# EAGLE schematic generation_board_f1 (EAGLE 8.7.1)
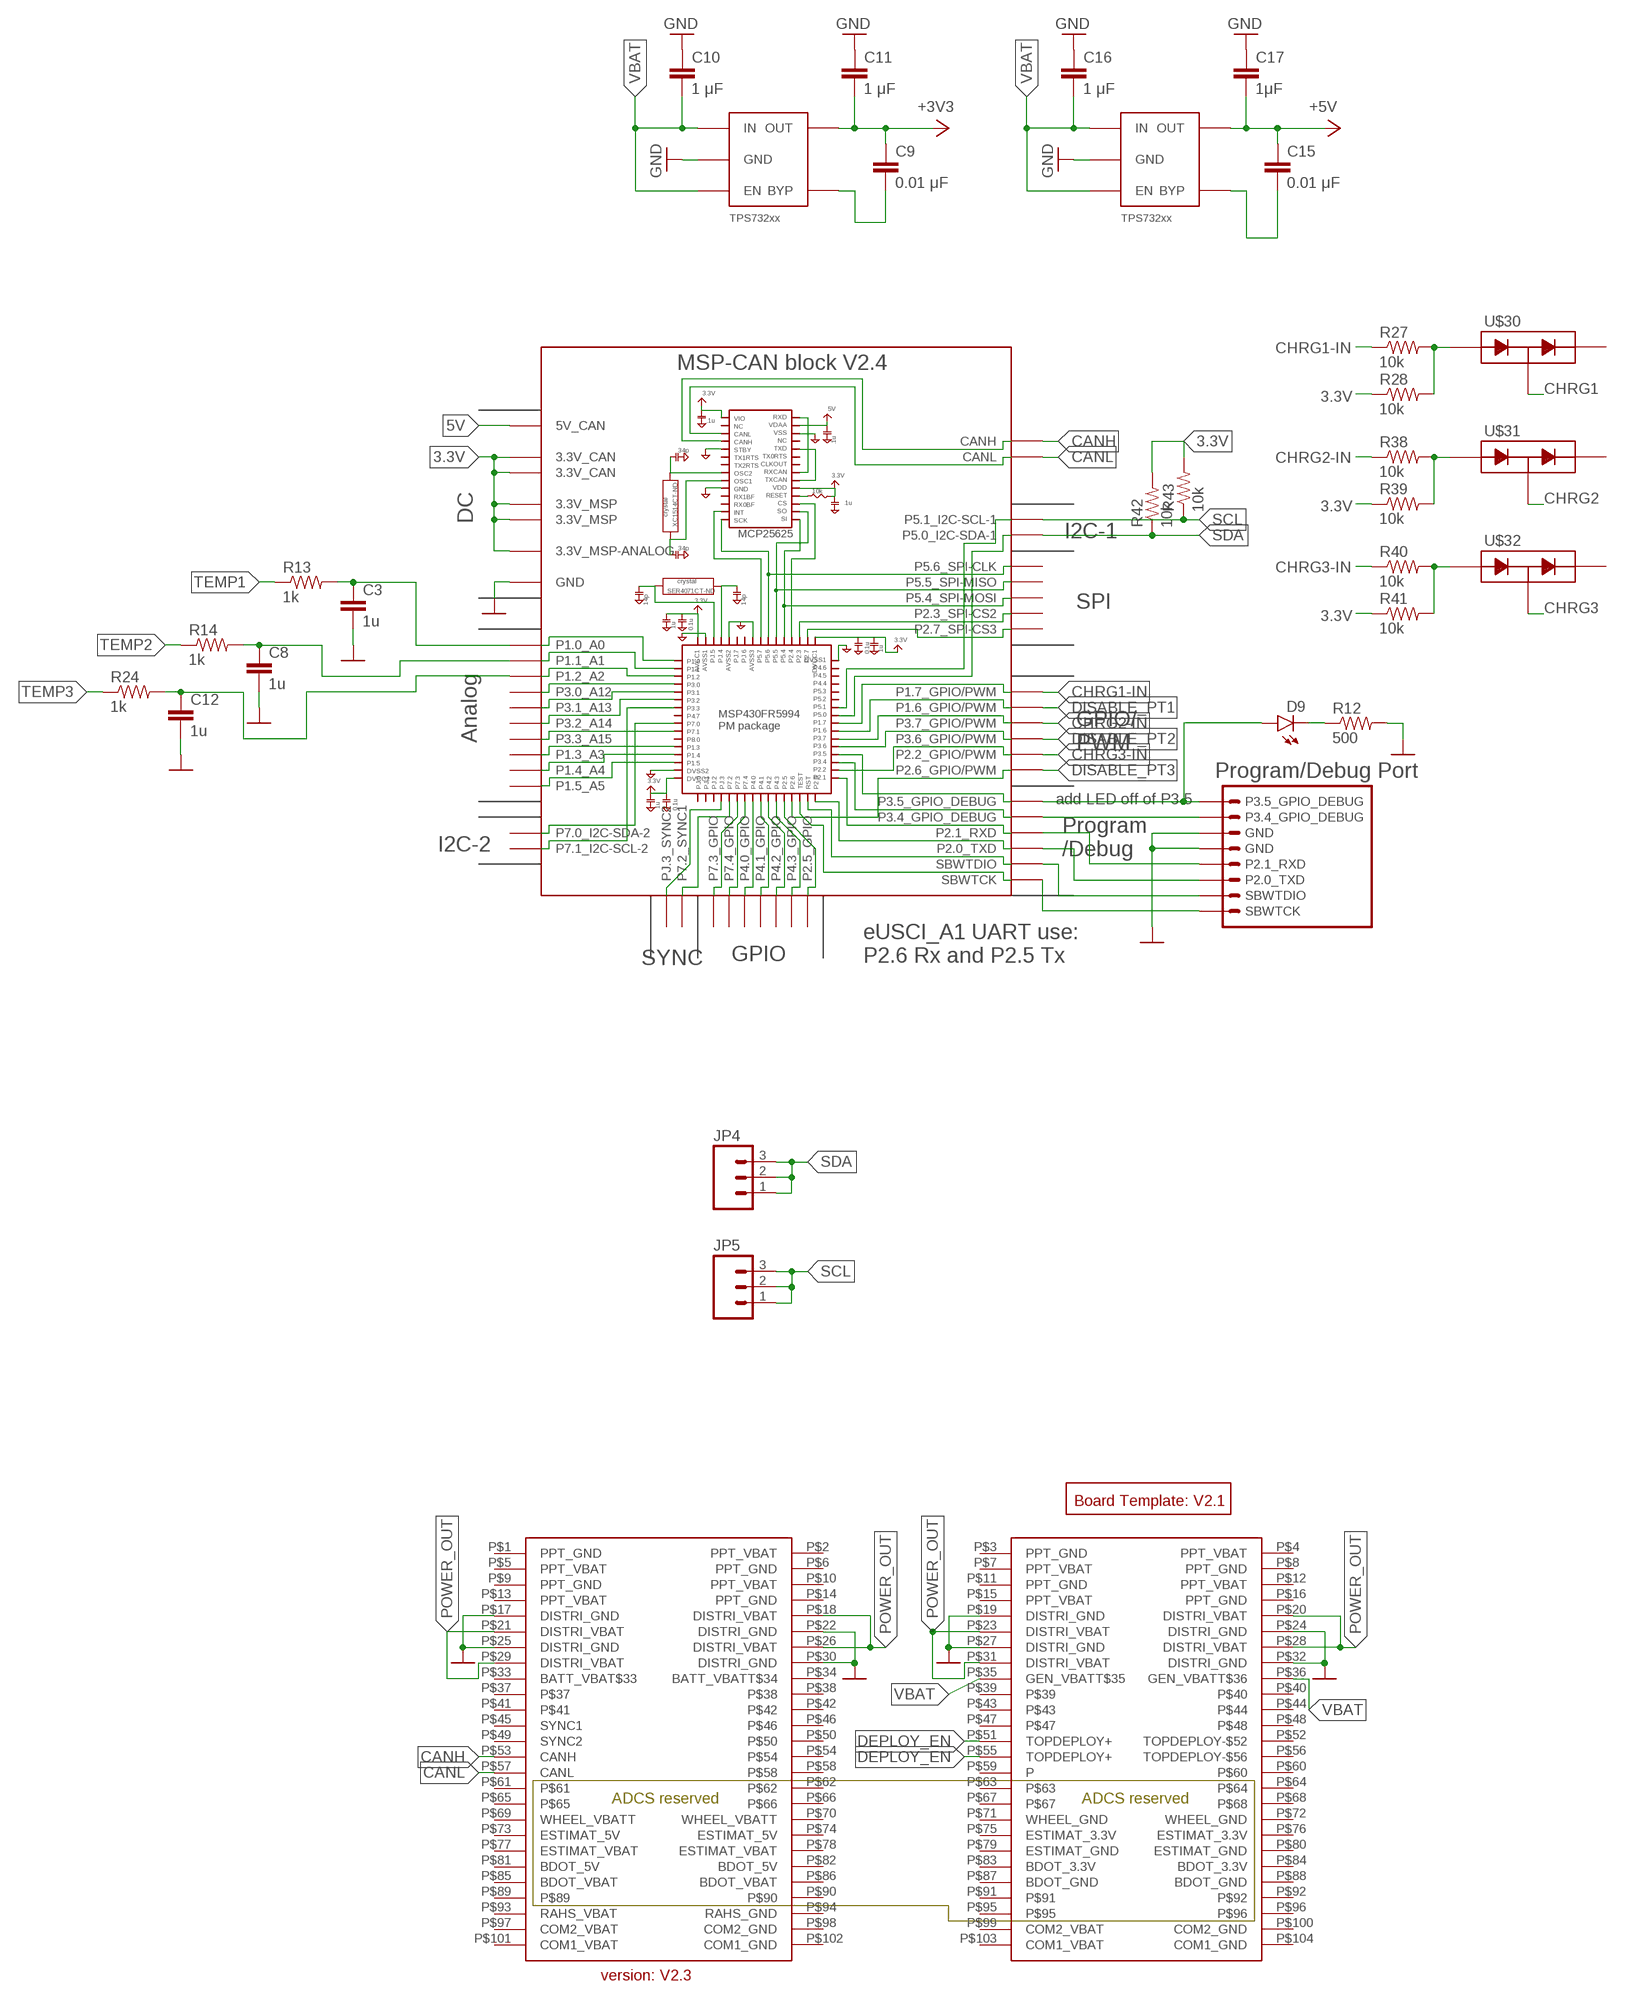
[diagram p0: schematic, sheet 1, part 1 of 2]
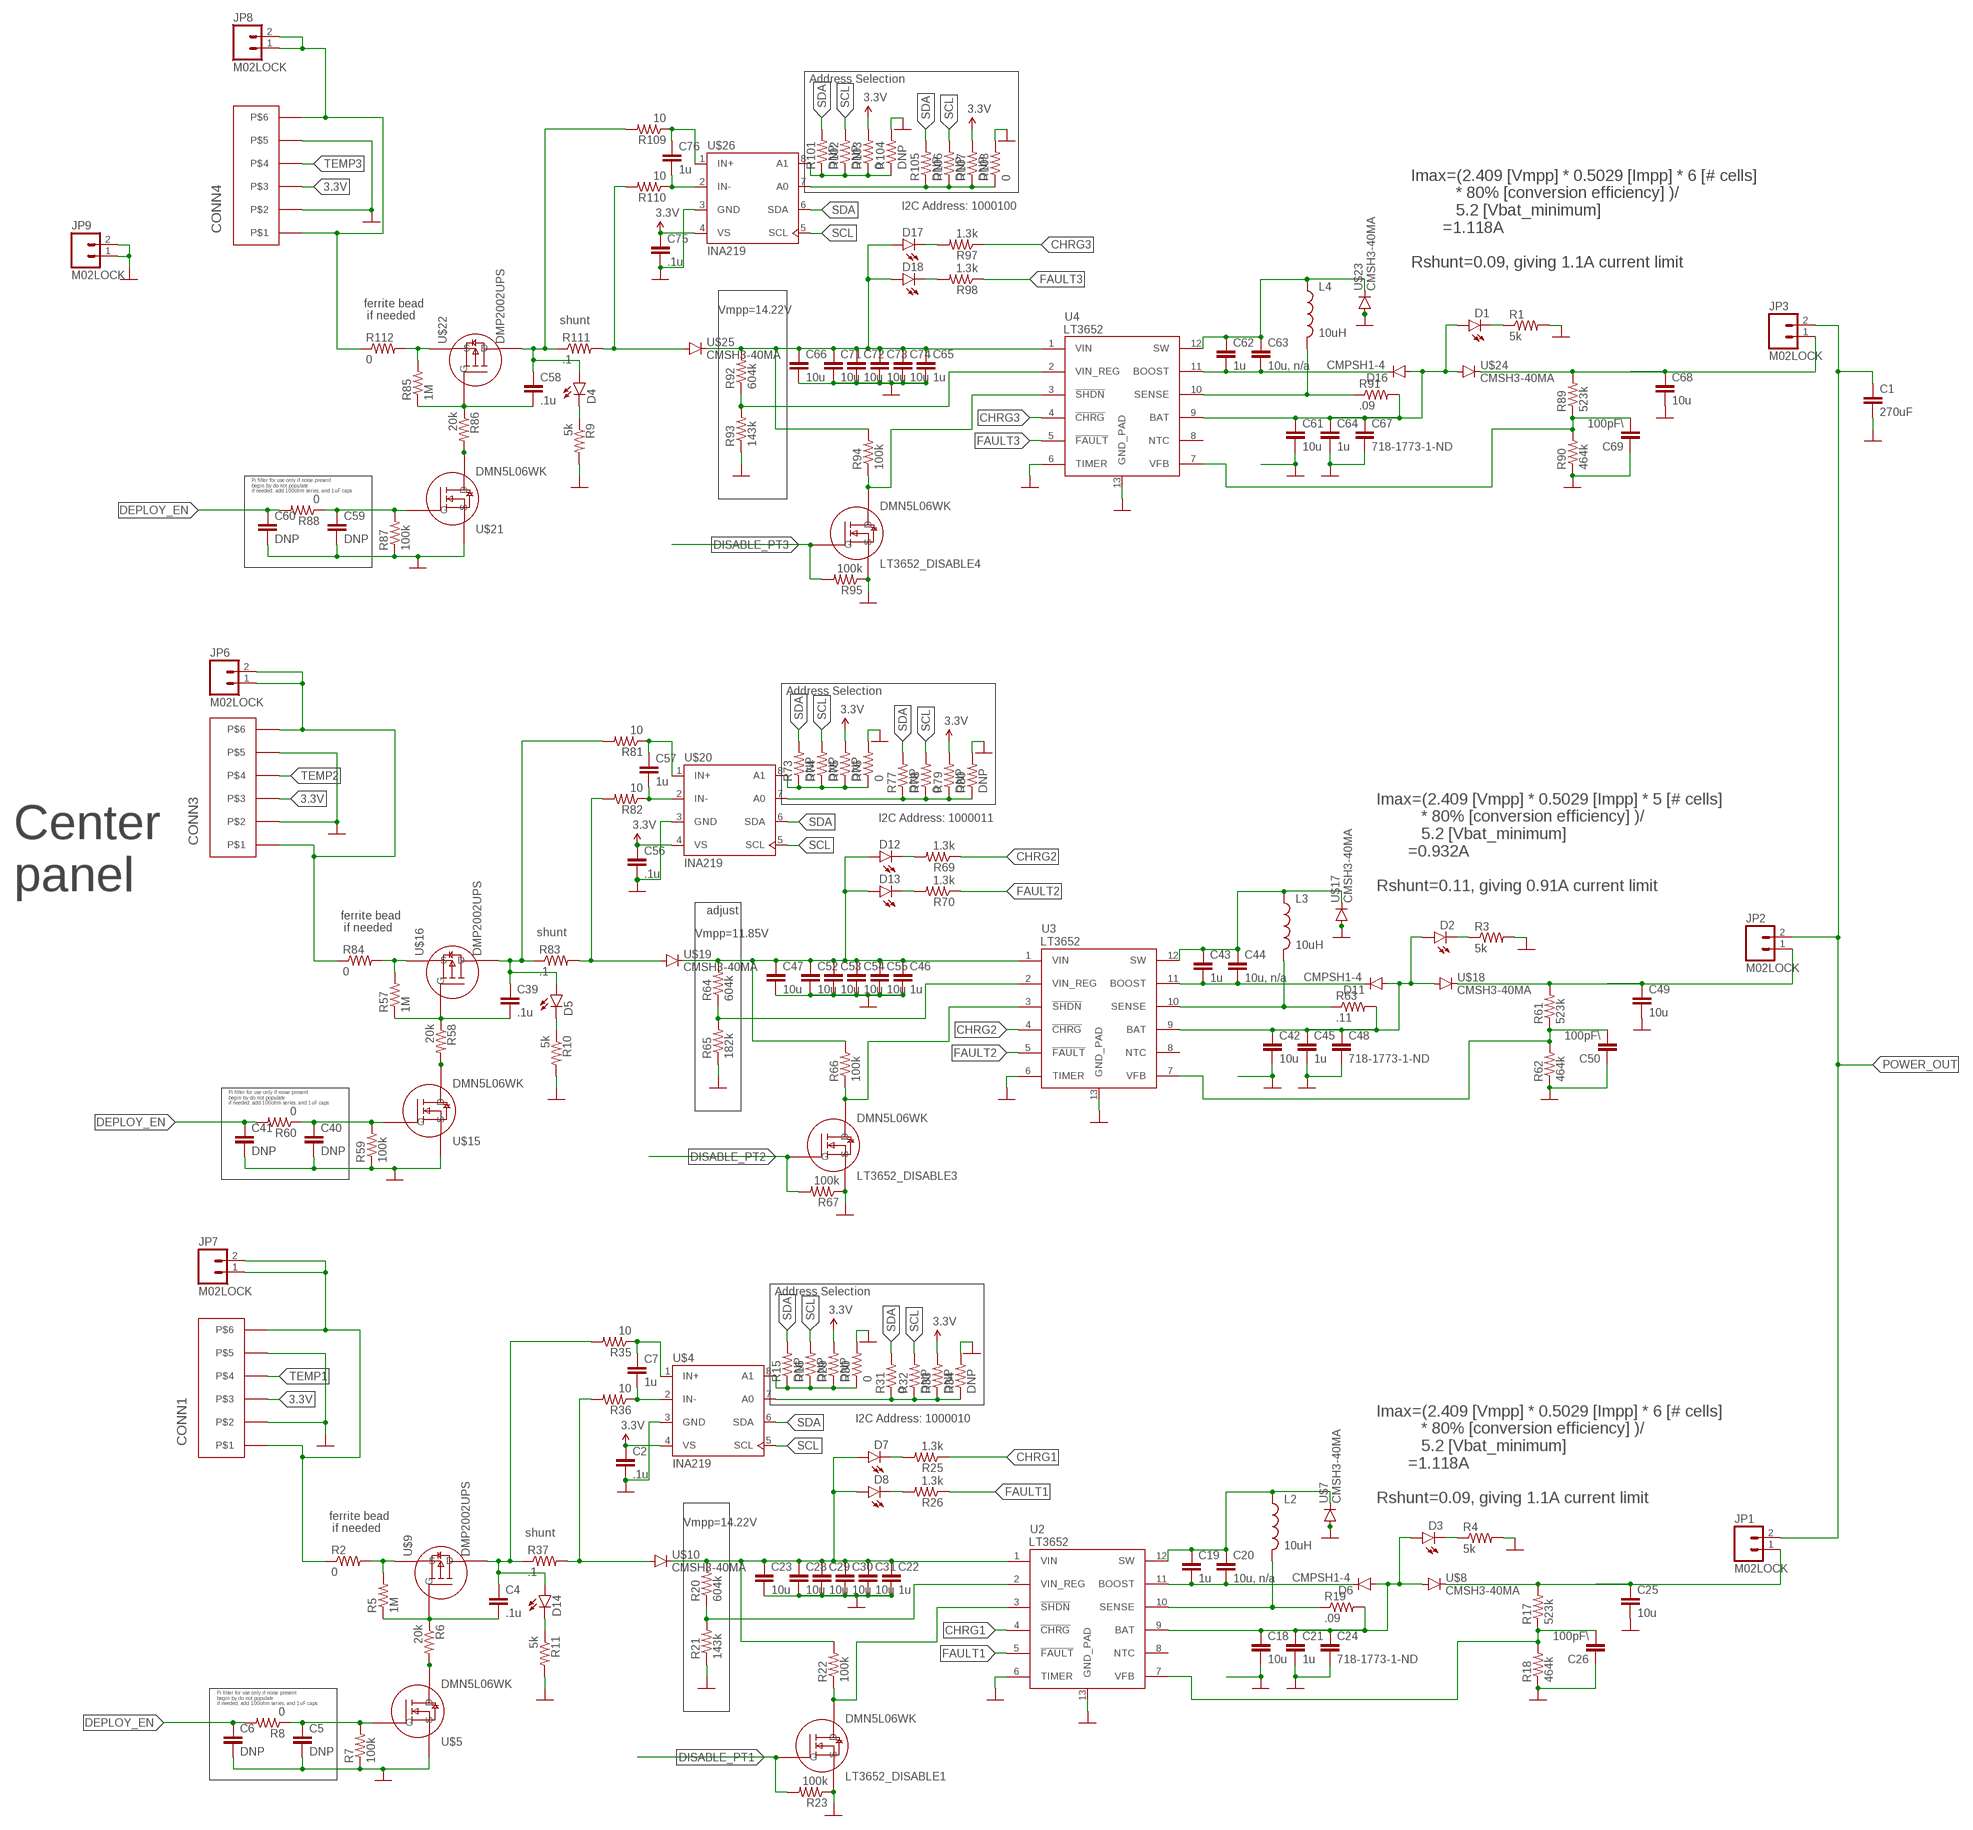
[diagram p1: schematic, sheet 1, part 2 of 2]

## Parts
BLK1  MSP-CAN_BLOCK  [MSP-CAN_BLOCK]
C1  270uF  CAPACITOR2917  [2917]
C2  .1u  CAPACITOR0805  [0805]
C3  1u  CAPACITOR0805  [0805]
C4  .1u  CAPACITOR0805  [0805]
C5  DNP  CAPACITOR0805  [0805]
C6  DNP  CAPACITOR0805  [0805]
C7  1u  CAPACITOR0805  [0805]
C8  1u  CAPACITOR0805  [0805]
C9  0.01 μF  CAPACITOR0805  [0805]
C10  1 μF  CAPACITOR0805  [0805]
C11  1 μF  CAPACITOR0805  [0805]
C12  1u  CAPACITOR0805  [0805]
C15  0.01 μF  CAPACITOR0805  [0805]
C16  1 μF  CAPACITOR0805  [0805]
C17  1μF  CAPACITOR0805  [0805]
C18  10u  CAPACITOR0805  [0805]
C19  1u  CAPACITOR0805  [0805]
C20  10u, n/a  CAPACITOR0805  [0805]
C21  1u  CAPACITOR0805  [0805]
C22  1u  CAPACITOR0805  [0805]
C23  10u  CAPACITOR1210  [1210]
C24  718-1773-1-ND  CAPACITOR2917  [2917]
C25  10u  CAPACITOR0805  [0805]
C26  100pF\  CAPACITOR0805  [0805]
C28  10u  CAPACITOR1210  [1210]
C29  10u  CAPACITOR1210  [1210]
C30  10u  CAPACITOR1210  [1210]
C31  10u  CAPACITOR1210  [1210]
C39  .1u  CAPACITOR0805  [0805]
C40  DNP  CAPACITOR0805  [0805]
C41  DNP  CAPACITOR0805  [0805]
C42  10u  CAPACITOR0805  [0805]
C43  1u  CAPACITOR0805  [0805]
C44  10u, n/a  CAPACITOR0805  [0805]
C45  1u  CAPACITOR0805  [0805]
C46  1u  CAPACITOR0805  [0805]
C47  10u  CAPACITOR1210  [1210]
C48  718-1773-1-ND  CAPACITOR2917  [2917]
C49  10u  CAPACITOR0805  [0805]
C50  100pF\  CAPACITOR0805  [0805]
C52  10u  CAPACITOR1210  [1210]
C53  10u  CAPACITOR1210  [1210]
C54  10u  CAPACITOR1210  [1210]
C55  10u  CAPACITOR1210  [1210]
C56  .1u  CAPACITOR0805  [0805]
C57  1u  CAPACITOR0805  [0805]
C58  .1u  CAPACITOR0805  [0805]
C59  DNP  CAPACITOR0805  [0805]
C60  DNP  CAPACITOR0805  [0805]
C61  10u  CAPACITOR0805  [0805]
C62  1u  CAPACITOR0805  [0805]
C63  10u, n/a  CAPACITOR0805  [0805]
C64  1u  CAPACITOR0805  [0805]
C65  1u  CAPACITOR0805  [0805]
C66  10u  CAPACITOR1210  [1210]
C67  718-1773-1-ND  CAPACITOR2917  [2917]
C68  10u  CAPACITOR0805  [0805]
C69  100pF\  CAPACITOR0805  [0805]
C71  10u  CAPACITOR1210  [1210]
C72  10u  CAPACITOR1210  [1210]
C73  10u  CAPACITOR1210  [1210]
C74  10u  CAPACITOR1210  [1210]
C75  .1u  CAPACITOR0805  [0805]
C76  1u  CAPACITOR0805  [0805]
CONN1  PICOLOCK_6  [PICOLOCK_6]
CONN3  PICOLOCK_6  [PICOLOCK_6]
CONN4  PICOLOCK_6  [PICOLOCK_6]
D1  LED  [LED-1206]
D2  LED  [LED-1206]
D3  LED  [LED-1206]
D4  LED  [LED-1206]
D5  LED  [LED-1206]
D6  CMPSH1-4  DIODESOT23  [SOT23-3]
D7  LED  [LED-1206]
D8  LED  [LED-1206]
D9  LED  [LED-1206]
D11  CMPSH1-4  DIODESOT23  [SOT23-3]
D12  LED  [LED-1206]
D13  LED  [LED-1206]
D14  LED  [LED-1206]
D16  CMPSH1-4  DIODESOT23  [SOT23-3]
D17  LED  [LED-1206]
D18  LED  [LED-1206]
JP1  M02LOCK  [1X02_LOCK]
JP2  M02LOCK  [1X02_LOCK]
JP3  M02LOCK  [1X02_LOCK]
JP4  M03LOCK  [1X03_LOCK]
JP5  M03LOCK  [1X03_LOCK]
JP6  M02LOCK  [1X02_LOCK]
JP7  M02LOCK  [1X02_LOCK]
JP8  M02LOCK  [1X02_LOCK]
JP9  M02LOCK  [1X02_LOCK]
L2  10uH  INDUCTOR1  [VISHAY_SERIES_01]
L3  10uH  INDUCTOR1  [VISHAY_SERIES_01]
L4  10uH  INDUCTOR1  [VISHAY_SERIES_01]
LT3652_DISABLE1  DMN5L06WK  [SOT-323]
LT3652_DISABLE3  DMN5L06WK  [SOT-323]
LT3652_DISABLE4  DMN5L06WK  [SOT-323]
R1  5k  RESISTOR0805  [0805]
R2  0  RESISTOR0805  [0805]
R3  5k  RESISTOR0805  [0805]
R4  5k  RESISTOR0805  [0805]
R5  1M  RESISTOR0805  [0805]
R6  20k  RESISTOR0805  [0805]
R7  100k  RESISTOR0805  [0805]
R8  0  RESISTOR0805  [0805]
R9  5k  RESISTOR0805  [0805]
R10  5k  RESISTOR0805  [0805]
R11  5k  RESISTOR0805  [0805]
R12  500  RESISTOR0805  [0805]
R13  1k  RESISTOR0805  [0805]
R14  1k  RESISTOR0805  [0805]
R15  DNP  RESISTOR0805  [0805]
R16  DNP  RESISTOR0805  [0805]
R17  523k  RESISTOR0805  [0805]
R18  464k  RESISTOR0805  [0805]
R19  .09  RESISTOR2010  [R2010]
R20  604k  RESISTOR0805  [0805]
R21  143k  RESISTOR0805  [0805]
R22  100k  RESISTOR0805  [0805]
R23  100k  RESISTOR0805  [0805]
R24  1k  RESISTOR0805  [0805]
R25  1.3k  RESISTOR0805  [0805]
R26  1.3k  RESISTOR0805  [0805]
R27  10k  RESISTOR0805  [0805]
R28  10k  RESISTOR0805  [0805]
R29  DNP  RESISTOR0805  [0805]
R30  0  RESISTOR0805  [0805]
R31  0  RESISTOR0805  [0805]
R32  DNP  RESISTOR0805  [0805]
R33  DNP  RESISTOR0805  [0805]
R34  DNP  RESISTOR0805  [0805]
R35  10  RESISTOR0805  [0805]
R36  10  RESISTOR0805  [0805]
R37  .1  RESISTOR2010  [R2010]
R38  10k  RESISTOR0805  [0805]
R39  10k  RESISTOR0805  [0805]
R40  10k  RESISTOR0805  [0805]
R41  10k  RESISTOR0805  [0805]
R42  10k  RESISTOR0805  [0805]
R43  10k  RESISTOR0805  [0805]
R57  1M  RESISTOR0805  [0805]
R58  20k  RESISTOR0805  [0805]
R59  100k  RESISTOR0805  [0805]
R60  0  RESISTOR0805  [0805]
R61  523k  RESISTOR0805  [0805]
R62  464k  RESISTOR0805  [0805]
R63  .11  RESISTOR2010  [R2010]
R64  604k  RESISTOR0805  [0805]
R65  182k  RESISTOR0805  [0805]
R66  100k  RESISTOR0805  [0805]
R67  100k  RESISTOR0805  [0805]
R69  1.3k  RESISTOR0805  [0805]
R70  1.3k  RESISTOR0805  [0805]
R73  DNP  RESISTOR0805  [0805]
R74  DNP  RESISTOR0805  [0805]
R75  DNP  RESISTOR0805  [0805]
R76  0  RESISTOR0805  [0805]
R77  DNP  RESISTOR0805  [0805]
R78  0  RESISTOR0805  [0805]
R79  DNP  RESISTOR0805  [0805]
R80  DNP  RESISTOR0805  [0805]
R81  10  RESISTOR0805  [0805]
R82  10  RESISTOR0805  [0805]
R83  .1  RESISTOR2010  [R2010]
R84  0  RESISTOR0805  [0805]
R85  1M  RESISTOR0805  [0805]
R86  20k  RESISTOR0805  [0805]
R87  100k  RESISTOR0805  [0805]
R88  0  RESISTOR0805  [0805]
R89  523k  RESISTOR0805  [0805]
R90  464k  RESISTOR0805  [0805]
R91  .09  RESISTOR2010  [R2010]
R92  604k  RESISTOR0805  [0805]
R93  143k  RESISTOR0805  [0805]
R94  100k  RESISTOR0805  [0805]
R95  100k  RESISTOR0805  [0805]
R97  1.3k  RESISTOR0805  [0805]
R98  1.3k  RESISTOR0805  [0805]
R101  DNP  RESISTOR0805  [0805]
R102  DNP  RESISTOR0805  [0805]
R103  0  RESISTOR0805  [0805]
R104  DNP  RESISTOR0805  [0805]
R105  DNP  RESISTOR0805  [0805]
R106  DNP  RESISTOR0805  [0805]
R107  DNP  RESISTOR0805  [0805]
R108  0  RESISTOR0805  [0805]
R109  10  RESISTOR0805  [0805]
R110  10  RESISTOR0805  [0805]
R111  .1  RESISTOR2010  [R2010]
R112  0  RESISTOR0805  [0805]
U2  LT3652  [MSOP-12_GND]
U3  LT3652  [MSOP-12_GND]
U4  LT3652  [MSOP-12_GND]
U5  TPS732XX  [SOT-23-5]
U7  TPS732XX  [SOT-23-5]
U$1  PC104_CONNECTOR  [PC104_CONNECTOR]
U$2  BOARD_TEMPLATE1  [BOARD_TEMPLATE]
U$3  PROGRAM/DEBUG_PORT  [1X08_CONNECTOR]
U$4  INA219  [SOT-23-8]
U$5  DMN5L06WK  [SOT-323]
U$7  CMSH3-40MA  [SMA-DIODE]
U$8  CMSH3-40MA  [SMA-DIODE]
U$9  DMP2002UPS  [POWERDI5060-8]
U$10  CMSH3-40MA  [SMA-DIODE]
U$15  DMN5L06WK  [SOT-323]
U$16  DMP2002UPS  [POWERDI5060-8]
U$17  CMSH3-40MA  [SMA-DIODE]
U$18  CMSH3-40MA  [SMA-DIODE]
U$19  CMSH3-40MA  [SMA-DIODE]
U$20  INA219  [SOT-23-8]
U$21  DMN5L06WK  [SOT-323]
U$22  DMP2002UPS  [POWERDI5060-8]
U$23  CMSH3-40MA  [SMA-DIODE]
U$24  CMSH3-40MA  [SMA-DIODE]
U$25  CMSH3-40MA  [SMA-DIODE]
U$26  INA219  [SOT-23-8]
U$30  ONSEMI_DIODE_BAT54SL  [SOT23-3]
U$31  ONSEMI_DIODE_BAT54SL  [SOT23-3]
U$32  ONSEMI_DIODE_BAT54SL  [SOT23-3]

## Nets
3.3V: BLK1.3.3V@CAN1(3.3V_CAN) BLK1.3.3V@CAN2(3.3V_CAN) BLK1.3.3V@MSP1(3.3V_MSP) BLK1.3.3V@MSP2(3.3V_MSP) BLK1.3.3V_ANALOG@MSP2(3.3V_MSP-ANALOG) C2.1 C9.1 C11.2 C56.1 C75.1 CONN1.P$3 CONN3.P$3 CONN4.P$3 R28.1 R29.2 R33.2 R39.1 R41.1 R42.2 R43.2 R75.2 R79.2 R103.2 R107.2 U5.P$5(OUT) U$4.4(VS) U$20.4(VS) U$26.4(VS) ; supply symbol labelled +3V3
5V: BLK1.5V(5V_CAN) C15.1 C17.2 U7.P$5(OUT) ; supply symbol labelled +5V
BAT1: C18.1 C21.1 C24.1 D3.A D6.1(A) R19.2 U2.9(BAT) U$8.A
BAT2: C42.1 C45.1 C48.1 D2.A D11.1(A) R63.2 U3.9(BAT) U$18.A
BAT3: C61.1 C64.1 C67.1 D1.A D16.1(A) R91.2 U4.9(BAT) U$24.A
BOOST1: C19.2 C20.2 D6.3(C) U2.11(BOOST)
BOOST2: C43.2 C44.2 D11.3(C) U3.11(BOOST)
BOOST3: C62.2 C63.2 D16.3(C) U4.11(BOOST)
CANH: BLK1.CANH U$1.P$53(CANH)
CANL: BLK1.CANL U$1.P$57(CANL)
CHRG1: R25.1 U2.4(!CHRG) U$30.3
CHRG1-IN: BLK1.P1.7_GPIO/PWM R27.1
CHRG2: R69.1 U3.4(!CHRG) U$31.3
CHRG2-IN: BLK1.P3.7_GPIO/PWM R38.1
CHRG3: R97.1 U4.4(!CHRG) U$32.3
CHRG3-IN: BLK1.P2.2_GPIO/PWM R40.1
DEPLOY_EN: C6.1 C41.1 C60.1 R8.2 R60.2 R88.2 U$1.P$51(TOPDEPLOY+) U$1.P$55(TOPDEPLOY+)
DISABLE_PT1: BLK1.P1.6_GPIO/PWM LT3652_DISABLE1.1(G) R23.2
DISABLE_PT2: BLK1.P3.6_GPIO/PWM LT3652_DISABLE3.1(G) R67.2
DISABLE_PT3: BLK1.P2.6_GPIO/PWM LT3652_DISABLE4.1(G) R95.2
FAULT1: R26.1 U2.5(!FAULT)
FAULT2: R70.1 U3.5(!FAULT)
FAULT3: R98.1 U4.5(!FAULT)
GND: BLK1.GND@1(GND) BLK1.GND@2(GND) BLK1.GND@3(GND) BLK1.GND@4(GND) BLK1.GND@5(GND) BLK1.GND@7(GND) BLK1.GND@8(GND) BLK1.GND@9(GND) BLK1.GND@10(GND) BLK1.GND@11(GND) BLK1.GND@12(GND) BLK1.GND@13(GND) BLK1.GND@14(GND) BLK1.GND@15(GND) BLK1.GND@16(GND) BLK1.GND@17(GND) BLK1.GND@26(GND) C1.2 C2.2 C3.2 C5.2 C6.2 C8.2 C10.1 C11.1 C12.2 C16.1 C17.1 C18.2 C21.2 C22.2 C23.2 C24.2 C25.2 C26.1 C28.2 C29.2 C30.2 C31.2 C40.2 C41.2 C42.2 C45.2 C46.2 C47.2 C48.2 C49.2 C50.1 C52.2 C53.2 C54.2 C55.2 C56.2 C59.2 C60.2 C61.2 C64.2 C65.2 C66.2 C67.2 C68.2 C69.1 C71.2 C72.2 C73.2 C74.2 C75.2 CONN1.P$2 CONN1.P$5 CONN3.P$2 CONN3.P$5 CONN4.P$2 CONN4.P$5 JP9.1 JP9.2 LT3652_DISABLE1.2(S) LT3652_DISABLE3.2(S) LT3652_DISABLE4.2(S) R1.2 R3.2 R4.2 R7.1 R9.2 R10.2 R11.2 R12.2 R18.1 R21.1 R23.1 R30.2 R34.2 R59.1 R62.1 R65.1 R67.1 R76.2 R80.2 R87.1 R90.1 R93.1 R95.1 R104.2 R108.2 U2.6(TIMER) U2.13(GND_PAD) U3.6(TIMER) U3.13(GND_PAD) U4.6(TIMER) U4.13(GND_PAD) U5.P$2(GND) U7.P$2(GND) U$1.P$17(DISTRI_GND) U$1.P$19(DISTRI_GND) U$1.P$22(DISTRI_GND) U$1.P$24(DISTRI_GND) U$1.P$25(DISTRI_GND) U$1.P$27(DISTRI_GND) U$1.P$30(DISTRI_GND) U$1.P$32(DISTRI_GND) U$3.5(GND) U$3.6(GND) U$4.3(GND) U$5.2(S) U$7.A U$15.2(S) U$17.A U$20.3(GND) U$21.2(S) U$23.A U$26.3(GND) ; supply symbol labelled DGND
IN1: R2.2 R5.2 U$9.S1(S) U$9.S2(S) U$9.S3(S)
IN2: R57.2 R84.2 U$16.S1(S) U$16.S2(S) U$16.S3(S)
IN3: R85.2 R112.2 U$22.S1(S) U$22.S2(S) U$22.S3(S)
INA219_A0_1: R31.1 R32.1 R33.1 R34.1 U$4.7(A0)
INA219_A0_2: R77.1 R78.1 R79.1 R80.1 U$20.7(A0)
INA219_A0_3: R105.1 R106.1 R107.1 R108.1 U$26.7(A0)
INA219_A1_1: R15.1 R16.1 R29.1 R30.1 U$4.8(A1)
INA219_A1_2: R73.1 R74.1 R75.1 R76.1 U$20.8(A1)
INA219_A1_3: R101.1 R102.1 R103.1 R104.1 U$26.8(A1)
INA219_IN+_1: C7.1 R35.1 U$4.1(IN+)
INA219_IN+_2: C57.1 R81.1 U$20.1(IN+)
INA219_IN+_3: C76.1 R109.1 U$26.1(IN+)
INA219_IN-_1: C7.2 R36.1 U$4.2(IN-)
INA219_IN-_2: C57.2 R82.1 U$20.2(IN-)
INA219_IN-_3: C76.2 R110.1 U$26.2(IN-)
INPUT_PANEL1: CONN1.P$1 CONN1.P$6 JP7.1 JP7.2 R2.1
INPUT_PANEL2: CONN3.P$1 CONN3.P$6 JP6.1 JP6.2 R84.1
INPUT_PANEL3: CONN4.P$1 CONN4.P$6 JP8.1 JP8.2 R112.1
LDO_3V3_BYP2: C9.2 U5.P$4(BYP)
LDO_5V_BYP2: C15.2 U7.P$4(BYP)
LOAD1: R36.2 R37.2 U$10.A
LOAD2: R82.2 R83.2 U$19.A
LOAD3: R110.2 R111.2 U$25.A
N$1: C4.2 R5.1 R6.1 U$9.G
N$2: C5.1 R7.2 R8.1 U$5.1(G)
N$3: BLK1.P3.5_GPIO_DEBUG D9.A U$3.8(P3.5_GPIO_DEBUG)
N$4: BLK1.P3.4_GPIO_DEBUG U$3.7(P3.4_GPIO_DEBUG)
N$5: BLK1.P2.1_RXD U$3.4(P2.1_RXD)
N$6: R6.2 U$5.3(D)
N$7: BLK1.P2.0_TXD U$3.3(P2.0_TXD)
N$8: BLK1.SBWTDIO U$3.2(SBWTDIO)
N$9: BLK1.SBWTCK U$3.SBWTCK
N$10: D1.C R1.1
N$11: D2.C R3.1
N$12: D3.C R4.1
N$13: D4.C R9.1
N$14: C39.2 R57.1 R58.1 U$16.G
N$15: C40.1 R59.2 R60.1 U$15.1(G)
N$16: LT3652_DISABLE1.3(D) R22.1 U2.3(!SHDN)
N$17: D8.C R26.2
N$18: D7.C R25.2
N$19: R58.2 U$15.3(D)
N$20: BLK1.P1.1_A1 C8.1 R14.2
N$21: D9.C R12.1
N$22: LT3652_DISABLE3.3(D) R66.1 U3.3(!SHDN)
N$23: D13.C R70.2
N$24: D12.C R69.2
N$25: D14.C R11.1
N$27: D5.C R10.1
N$28: C58.2 R85.1 R86.1 U$22.G
N$29: C59.1 R87.2 R88.1 U$21.1(G)
N$30: R86.2 U$21.3(D)
N$31: LT3652_DISABLE4.3(D) R94.1 U4.3(!SHDN)
N$32: D18.C R98.2
N$33: D17.C R97.2
N$34: BLK1.P1.2_A2 C12.1 R24.2
N$37: BLK1.P1.0_A0 C3.1 R13.2
N$41: R27.2 R28.2 U$30.1
N$42: R38.2 R39.2 U$31.1
N$43: R40.2 R41.2 U$32.1
OUT1: C4.1 D14.A R35.2 R37.1 U$9.D1(D) U$9.D2(D) U$9.D3(D) U$9.D4(D) U$9.D5(D)
OUT2: C39.1 D5.A R81.2 R83.1 U$16.D1(D) U$16.D2(D) U$16.D3(D) U$16.D4(D) U$16.D5(D)
OUT3: C58.1 D4.A R109.2 R111.1 U$22.D1(D) U$22.D2(D) U$22.D3(D) U$22.D4(D) U$22.D5(D)
OUTPUT1: C25.1 JP1.1 R17.2 U$8.C
OUTPUT2: C49.1 JP2.1 R61.2 U$18.C
OUTPUT3: C68.1 JP3.1 R89.2 U$24.C
POWER_OUT: C1.1 JP1.2 JP2.2 JP3.2 U$1.P$18(DISTRI_VBAT) U$1.P$20(DISTRI_VBAT) U$1.P$21(DISTRI_VBAT) U$1.P$23(DISTRI_VBAT) U$1.P$26(DISTRI_VBAT) U$1.P$28(DISTRI_VBAT) U$1.P$29(DISTRI_VBAT) U$1.P$31(DISTRI_VBAT)
SCL: BLK1.P5.1_I2C-SCL-1 JP5.1 JP5.2 JP5.3 R16.2 R32.2 R43.1 R74.2 R78.2 R102.2 R106.2 U$4.5(SCL) U$20.5(SCL) U$26.5(SCL)
SDA: BLK1.P5.0_I2C-SDA-1 JP4.1 JP4.2 JP4.3 R15.2 R31.2 R42.1 R73.2 R77.2 R101.2 R105.2 U$4.6(SDA) U$20.6(SDA) U$26.6(SDA)
SENSE1: L2.P$2 R19.1 U2.10(SENSE)
SENSE2: L3.P$2 R63.1 U3.10(SENSE)
SENSE3: L4.P$2 R91.1 U4.10(SENSE)
SW1: C19.1 C20.1 L2.P$1 U2.12(SW) U$7.C
SW2: C43.1 C44.1 L3.P$1 U3.12(SW) U$17.C
SW3: C62.1 C63.1 L4.P$1 U4.12(SW) U$23.C
TEMP1: CONN1.P$4 R13.1
TEMP2: CONN3.P$4 R14.1
TEMP3: CONN4.P$4 R24.1
VBAT: C10.2 C16.2 U5.P$1(IN) U5.P$3(EN) U7.P$1(IN) U7.P$3(EN) U$1.P$35(GEN_VBATT$35) U$1.P$36(GEN_VBATT$36)
VFB1: C26.2 R17.1 R18.2 U2.7(VFB)
VFB2: C50.2 R61.1 R62.2 U3.7(VFB)
VFB3: C69.2 R89.1 R90.2 U4.7(VFB)
VIN1: C22.1 C23.1 C28.1 C29.1 C30.1 C31.1 D7.A D8.A R20.2 R22.2 U2.1(VIN) U$10.C
VIN2: C46.1 C47.1 C52.1 C53.1 C54.1 C55.1 D12.A D13.A R64.2 R66.2 U3.1(VIN) U$19.C
VIN3: C65.1 C66.1 C71.1 C72.1 C73.1 C74.1 D17.A D18.A R92.2 R94.2 U4.1(VIN) U$25.C
VIN_REG1: R20.1 R21.2 U2.2(VIN_REG)
VIN_REG2: R64.1 R65.2 U3.2(VIN_REG)
VIN_REG3: R92.1 R93.2 U4.2(VIN_REG)
Unconnected: BLK1.P1.3_A3 BLK1.P1.4_A4 BLK1.P1.5_A5 BLK1.P2.4_SPI-CS2(P2.3_SPI-CS2) BLK1.P2.5_GPIO BLK1.P2.7_SPI-CS3 BLK1.P3.0_A12 BLK1.P3.1_A13 BLK1.P3.2_A14 BLK1.P3.3_A15 BLK1.P4.0_GPIO BLK1.P4.1_GPIO BLK1.P4.2_GPIO BLK1.P4.3_GPIO BLK1.P5.4_SPI-MOSI BLK1.P5.5_SPI-MISO BLK1.P5.6_SPI-CLK BLK1.P7.0_I2C-SDA-2 BLK1.P7.1_I2C-SCL-2 BLK1.P7.2_SYNC1 BLK1.P7.3_GPIO BLK1.P7.4_GPIO BLK1.PJ.3_SYNC2 U2.8(NTC) U3.8(NTC) U4.8(NTC) U$1.P$1(PPT_GND) U$1.P$2(PPT_VBAT) U$1.P$3(PPT_GND) U$1.P$4(PPT_VBAT) U$1.P$5(PPT_VBAT) U$1.P$6(PPT_GND) U$1.P$7(PPT_VBAT) U$1.P$8(PPT_GND) U$1.P$9(PPT_GND) U$1.P$10(PPT_VBAT) U$1.P$11(PPT_GND) U$1.P$12(PPT_VBAT) U$1.P$13(PPT_VBAT) U$1.P$14(PPT_GND) U$1.P$15(PPT_VBAT) U$1.P$16(PPT_GND) U$1.P$33(BATT_VBAT$33) U$1.P$34(BATT_VBATT$34) U$1.P$37 U$1.P$38 U$1.P$39 U$1.P$40 U$1.P$41 U$1.P$42 U$1.P$43 U$1.P$44 U$1.P$45(SYNC1) U$1.P$46 U$1.P$47 U$1.P$48 U$1.P$49(SYNC2) U$1.P$50 U$1.P$52(TOPDEPLOY-$52) U$1.P$54 U$1.P$56(TOPDEPLOY-$56) U$1.P$58 U$1.P$59(P) U$1.P$60 U$1.P$61 U$1.P$62 U$1.P$63 U$1.P$64 U$1.P$65 U$1.P$66 U$1.P$67 U$1.P$68 U$1.P$69(WHEEL_VBATT) U$1.P$70(WHEEL_VBATT) U$1.P$71(WHEEL_GND) U$1.P$72(WHEEL_GND) U$1.P$73(ESTIMAT_5V) U$1.P$74(ESTIMAT_5V) U$1.P$75(ESTIMAT_3.3V) U$1.P$76(ESTIMAT_3.3V) U$1.P$77(ESTIMAT_VBAT) U$1.P$78(ESTIMAT_VBAT) U$1.P$79(ESTIMAT_GND) U$1.P$80(ESTIMAT_GND) U$1.P$81(BDOT_5V) U$1.P$82(BDOT_5V) U$1.P$83(BDOT_3.3V) U$1.P$84(BDOT_3.3V) U$1.P$85(BDOT_VBAT) U$1.P$86(BDOT_VBAT) U$1.P$87(BDOT_GND) U$1.P$88(BDOT_GND) U$1.P$89 U$1.P$90 U$1.P$91 U$1.P$92 U$1.P$93(RAHS_VBAT) U$1.P$94(RAHS_GND) U$1.P$95 U$1.P$96 U$1.P$97(COM2_VBAT) U$1.P$98(COM2_GND) U$1.P$99(COM2_VBAT) U$1.P$100(COM2_GND) U$1.P$101(COM1_VBAT) U$1.P$102(COM1_GND) U$1.P$103(COM1_VBAT) U$1.P$104(COM1_GND) U$30.2 U$31.2 U$32.2

## Notes on the sheet
- Address Selection
- I2C Address: 1000100
- Imax=(2.409 [Vmpp] * 0.5029 [Impp] * 6 [# cells]
            * 80% [conversion efficiency] )/ 
            5.2 [Vbat_minimum]
         =1.118A
  
  Rshunt=0.09, giving 1.1A current limit
- Vmpp=14.22V
- ferrite bead
   if needed
- shunt
- Pi filter for use only if noise present
  begin by do not populate
  if needed, add 100ohm series, and 1uF caps
- Address Selection
- I2C Address: 1000011
- Center
  panel
- Imax=(2.409 [Vmpp] * 0.5029 [Impp] * 5 [# cells]
            * 80% [conversion efficiency] )/ 
            5.2 [Vbat_minimum]
         =0.932A
  
  Rshunt=0.11, giving 0.91A current limit
- adjust
- ferrite bead
   if needed
- shunt | Vmpp=11.85V
- Pi filter for use only if noise present
  begin by do not populate
  if needed, add 100ohm series, and 1uF caps
- Address Selection
- I2C Address: 1000010
- Imax=(2.409 [Vmpp] * 0.5029 [Impp] * 6 [# cells]
            * 80% [conversion efficiency] )/ 
            5.2 [Vbat_minimum]
         =1.118A
  
  Rshunt=0.09, giving 1.1A current limit
- Vmpp=14.22V
- ferrite bead
   if needed
- shunt
- Pi filter for use only if noise present
  begin by do not populate
  if needed, add 100ohm series, and 1uF caps

## Library data of the parts
BLK1 = DubSat1 Components:MSP-CAN_BLOCK
C1-C12 C15-C26 C28-C31 C39-C50 C52-C69 C71-C76 = DubSat1 Components:CAPACITOR: Capacitor Standard 0603 ceramic capacitor, and 0.1" leaded capacitor.
CONN1 CONN3 CONN4 = DubSat1 Components:PICOLOCK_6
D1-D5 D7-D9 D12-D14 D17 D18 = DubSat1 Components:LED
D6 D11 D16 = SparkFun-DiscreteSemi:DIODE: Diode These are standard reverse protection diodes and small signal diodes. SMA package can handle up to about 1A. SOD-323 can handle about 200mA. What the SOD-323 package when ordering, there are some mfgs out there that are 5-pin packages.
JP1-JP3 JP6-JP9 = SparkFun-Connectors:M02: Standard 2-pin 0.1" header. Use with - straight break away headers ( PRT-00116) - right angle break away headers (PRT-00553) - swiss pins (PRT-00743) - machine pins (PRT-00117) - female headers (PRT-00115) Molex polarized connector foot print use with: PRT-08233 with associated crimp pins and housings. 2.54_SCREWTERM for use with PRT-10571. 3.5mm Screw Terminal footprints for PRT-08084 5mm Screw Terminal footprints for use with PRT-08432
JP4 JP5 = SparkFun-Connectors:M03: Header 3 Standard 3-pin 0.1" header. Use with straight break away headers (SKU : PRT-00116), right angle break away headers (PRT-00553), swiss pins (PRT-00743), machine pins (PRT-00117), and female headers (PRT-00115). Molex polarized connector foot print use with SKU : PRT-08232 with associated crimp pins and housings.
L2-L4 = DubSat1 Components:INDUCTOR
LT3652_DISABLE1 LT3652_DISABLE3 LT3652_DISABLE4 U$5 U$15 U$21 = DubSat1 Components:DMN5L06WK
R1-R43 R57-R67 R69 R70 R73-R95 R97 R98 R101-R112 = DubSat1 Components:RESISTOR: Resistor Basic schematic elements and footprints for 0603, 1206, and PTH resistors.
U2-U4 = SparkFun-PowerIC:LT3652: LT3652 MPPT Solar Charge Controller 5V-32V smart charger for batteries up to 14.4V
U5 U7 = DubSat1 Components:TPS732XX
U$1 = DubSat1 Components:PC104_CONNECTOR
U$2 = DubSat1 Components:BOARD_TEMPLATE
U$3 = DubSat1 Components:PROGRAM/DEBUG_PORT
U$4 U$20 U$26 = DubSat1 Components:INA219
U$7 U$8 U$10 U$17-U$19 U$23-U$25 = DubSat1 Components:CMSH3-40MA
U$9 U$16 U$22 = DubSat1 Components:DMP2002UPS
U$30-U$32 = ICs:ONSEMI_DIODE_BAT54SL

## Net classes
0 default: width 0.254 mm, drill 0.254 mm, clearance 0.152 mm